# EAGLE design 7segmentDisplay (EAGLE 7.6.0)
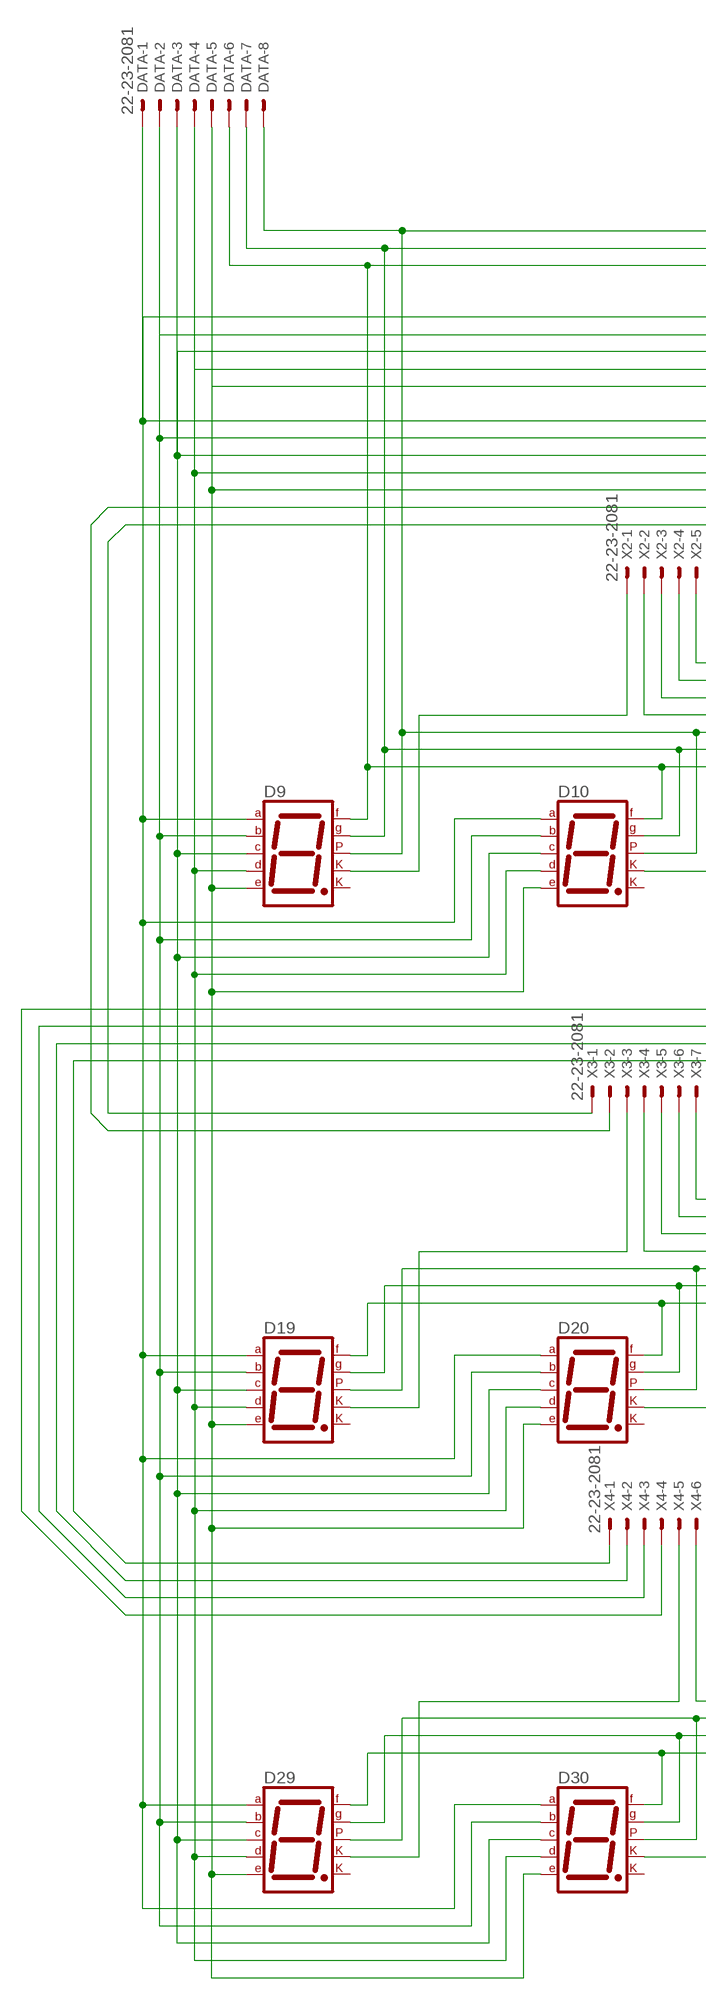
[diagram p0: schematic, sheet 1, part 1 of 2]
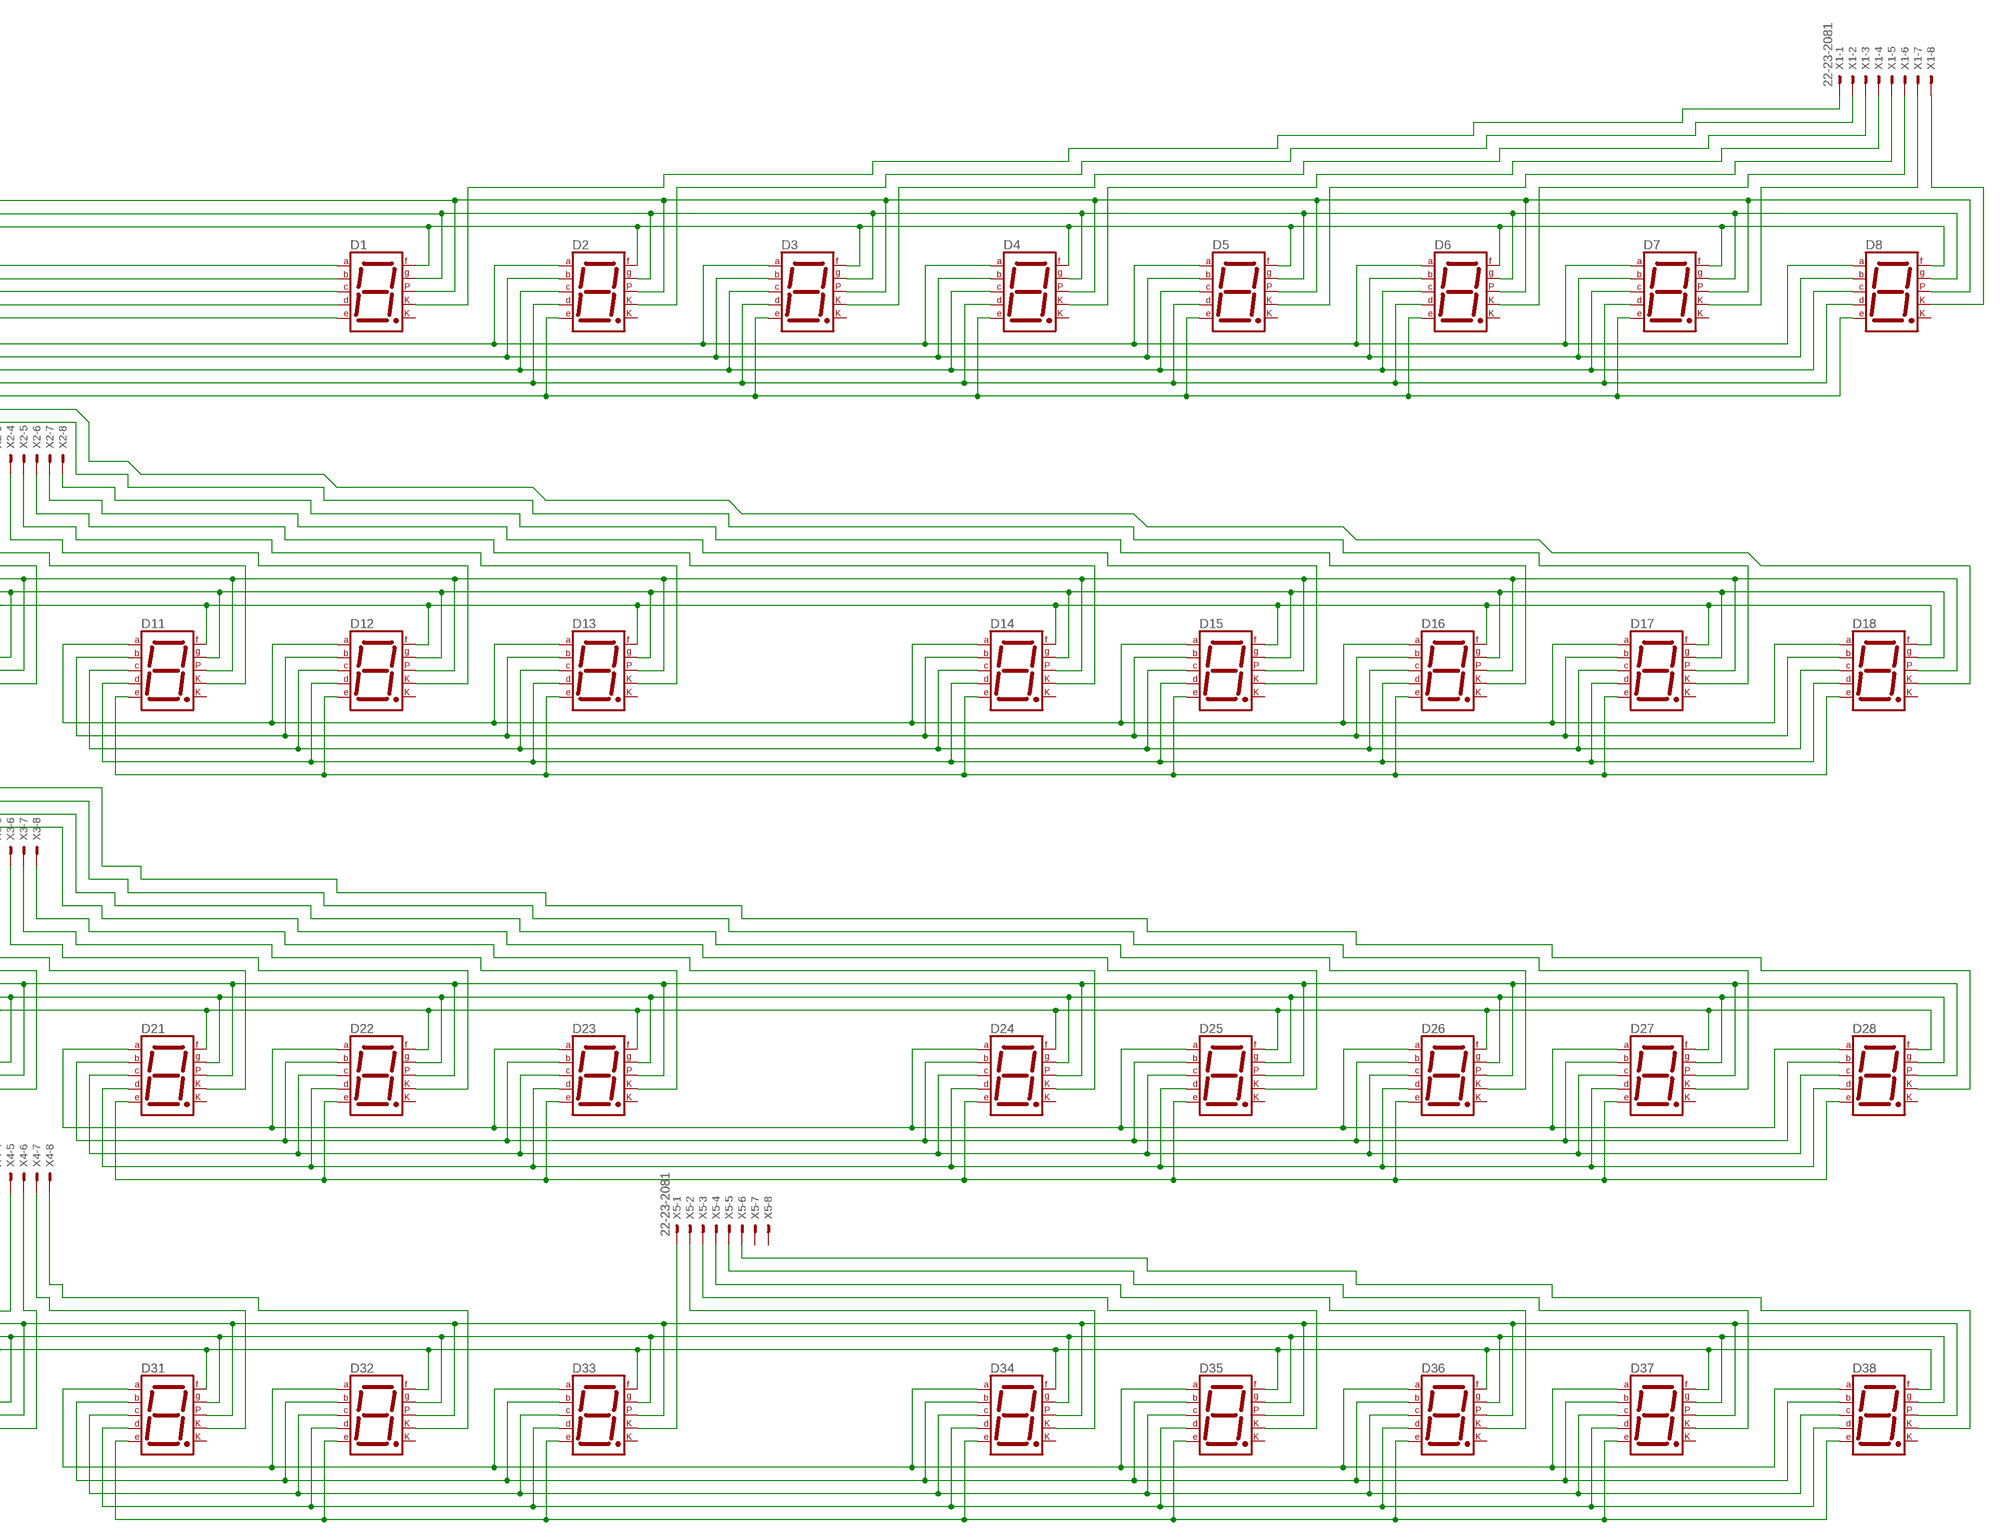
[diagram p1: schematic, sheet 1, part 2 of 2]

## Parts
D1  7SEG-CK  [7SEG-13]
D2  7SEG-CK  [7SEG-13]
D3  7SEG-CK  [7SEG-13]
D4  7SEG-CK  [7SEG-13]
D5  7SEG-CK  [7SEG-13]
D6  7SEG-CK  [7SEG-13]
D7  7SEG-CK  [7SEG-13]
D8  7SEG-CK  [7SEG-13]
D9  7SEG-CK  [7SEG-13]
D10  7SEG-CK  [7SEG-13]
D11  7SEG-CK  [7SEG-13]
D12  7SEG-CK  [7SEG-13]
D13  7SEG-CK  [7SEG-13]
D14  7SEG-CK  [7SEG-13]
D15  7SEG-CK  [7SEG-13]
D16  7SEG-CK  [7SEG-13]
D17  7SEG-CK  [7SEG-13]
D18  7SEG-CK  [7SEG-13]
D19  7SEG-CK  [7SEG-13]
D20  7SEG-CK  [7SEG-13]
D21  7SEG-CK  [7SEG-13]
D22  7SEG-CK  [7SEG-13]
D23  7SEG-CK  [7SEG-13]
D24  7SEG-CK  [7SEG-13]
D25  7SEG-CK  [7SEG-13]
D26  7SEG-CK  [7SEG-13]
D27  7SEG-CK  [7SEG-13]
D28  7SEG-CK  [7SEG-13]
D29  7SEG-CK  [7SEG-13]
D30  7SEG-CK  [7SEG-13]
D31  7SEG-CK  [7SEG-13]
D32  7SEG-CK  [7SEG-13]
D33  7SEG-CK  [7SEG-13]
D34  7SEG-CK  [7SEG-13]
D35  7SEG-CK  [7SEG-13]
D36  7SEG-CK  [7SEG-13]
D37  7SEG-CK  [7SEG-13]
D38  7SEG-CK  [7SEG-13]
DATA  22-23-2081  [22-23-2081]
X1  22-23-2081  [22-23-2081]
X2  22-23-2081  [22-23-2081]
X3  22-23-2081  [22-23-2081]
X4  22-23-2081  [22-23-2081]
X5  22-23-2081  [22-23-2081]

## Nets
N$1: D1.7(A) D2.7(A) D3.7(A) D4.7(A) D5.7(A) D6.7(A) D7.7(A) D8.7(A) D9.7(A) D10.7(A) D19.7(A) D20.7(A) D29.7(A) D30.7(A) DATA.1
N$2: D1.6(B) D2.6(B) D3.6(B) D4.6(B) D5.6(B) D6.6(B) D7.6(B) D8.6(B) D9.6(B) D10.6(B) D19.6(B) D20.6(B) D29.6(B) D30.6(B) DATA.2
N$3: D1.4(C) D2.4(C) D3.4(C) D4.4(C) D5.4(C) D6.4(C) D7.4(C) D8.4(C) D9.4(C) D10.4(C) D19.4(C) D20.4(C) D29.4(C) D30.4(C) DATA.3
N$4: D1.2(D) D2.2(D) D3.2(D) D4.2(D) D5.2(D) D6.2(D) D7.2(D) D8.2(D) D9.2(D) D10.2(D) D19.2(D) D20.2(D) D29.2(D) D30.2(D) DATA.4
N$5: D1.1(E) D2.1(E) D3.1(E) D4.1(E) D5.1(E) D6.1(E) D7.1(E) D8.1(E) D9.1(E) D10.1(E) D19.1(E) D20.1(E) D29.1(E) D30.1(E) DATA.5
N$6: D14.10(G) D15.10(G) D16.10(G) D17.10(G) D18.10(G)
N$7: D5.3(CK1) X1.5
N$8: D2.3(CK1) X1.2
N$9: D3.3(CK1) X1.3
N$10: D4.3(CK1) X1.4
N$11: D9.3(CK1) X2.1
N$12: D6.3(CK1) X1.6
N$13: D7.3(CK1) X1.7
N$14: D21.7(A) D22.7(A) D23.7(A)
N$15: D21.6(B) D22.6(B) D23.6(B)
N$16: D11.7(A) D12.7(A) D13.7(A)
N$17: D11.6(B) D12.6(B) D13.6(B)
N$18: D11.4(C) D12.4(C) D13.4(C)
N$19: D11.2(D) D12.2(D) D13.2(D)
N$20: D11.1(E) D12.1(E) D13.1(E)
N$21: D1.9(F) D2.9(F) D3.9(F) D4.9(F) D5.9(F) D6.9(F) D7.9(F) D8.9(F) D9.9(F) D10.9(F) D11.9(F) D12.9(F) D13.9(F) D14.9(F) D15.9(F) D16.9(F) D17.9(F) D18.9(F) DATA.6
N$22: D1.10(G) D2.10(G) D3.10(G) D4.10(G) D5.10(G) D6.10(G) D7.10(G) D8.10(G) D9.10(G) D10.10(G) D11.10(G) D12.10(G) D13.10(G) DATA.7
N$23: D1.5(DP) D2.5(DP) D3.5(DP) D4.5(DP) D5.5(DP) D6.5(DP) D7.5(DP) D8.5(DP) D9.5(DP) D10.5(DP) D11.5(DP) D12.5(DP) D13.5(DP) D14.5(DP) D15.5(DP) D16.5(DP) D17.5(DP) D18.5(DP) DATA.8
N$24: D8.3(CK1) X1.8
N$25: D11.3(CK1) X2.3
N$26: D14.7(A) D15.7(A) D16.7(A) D17.7(A) D18.7(A)
N$27: D14.6(B) D15.6(B) D16.6(B) D17.6(B) D18.6(B)
N$28: D14.4(C) D15.4(C) D16.4(C) D17.4(C) D18.4(C)
N$29: D14.2(D) D15.2(D) D16.2(D) D17.2(D) D18.2(D)
N$30: D14.1(E) D15.1(E) D16.1(E) D17.1(E) D18.1(E)
N$31: D21.4(C) D22.4(C) D23.4(C)
N$32: D21.2(D) D22.2(D) D23.2(D)
N$33: D21.1(E) D22.1(E) D23.1(E)
N$34: D19.9(F) D20.9(F) D21.9(F) D22.9(F) D23.9(F) D24.9(F) D25.9(F) D26.9(F) D27.9(F) D28.9(F)
N$35: D19.10(G) D20.10(G) D21.10(G) D22.10(G) D23.10(G)
N$36: D19.5(DP) D20.5(DP) D21.5(DP) D22.5(DP) D23.5(DP) D24.5(DP) D25.5(DP) D26.5(DP) D27.5(DP) D28.5(DP)
N$37: D12.3(CK1) X2.4
N$38: D13.3(CK1) X2.5
N$39: D24.7(A) D25.7(A) D26.7(A) D27.7(A) D28.7(A)
N$40: D24.6(B) D25.6(B) D26.6(B) D27.6(B) D28.6(B)
N$41: D24.4(C) D25.4(C) D26.4(C) D27.4(C) D28.4(C)
N$42: D24.2(D) D25.2(D) D26.2(D) D27.2(D) D28.2(D)
N$43: D24.1(E) D25.1(E) D26.1(E) D27.1(E) D28.1(E)
N$44: D24.10(G) D25.10(G) D26.10(G) D27.10(G) D28.10(G)
N$45: D14.3(CK1) X2.6
N$46: D15.3(CK1) X2.7
N$47: D1.3(CK1) X1.1
N$48: D16.3(CK1) X2.8
N$49: D18.3(CK1) X3.2
N$50: D10.3(CK1) X2.2
N$51: D23.3(CK1) X3.7
N$52: D31.7(A) D32.7(A) D33.7(A)
N$53: D31.6(B) D32.6(B) D33.6(B)
N$54: D31.4(C) D32.4(C) D33.4(C)
N$55: D31.2(D) D32.2(D) D33.2(D)
N$56: D31.1(E) D32.1(E) D33.1(E)
N$57: D29.9(F) D30.9(F) D31.9(F) D32.9(F) D33.9(F) D34.9(F) D35.9(F) D36.9(F) D37.9(F) D38.9(F)
N$58: D29.10(G) D30.10(G) D31.10(G) D32.10(G) D33.10(G)
N$59: D29.5(DP) D30.5(DP) D31.5(DP) D32.5(DP) D33.5(DP) D34.5(DP) D35.5(DP) D36.5(DP) D37.5(DP) D38.5(DP)
N$60: D19.3(CK1) X3.3
N$61: D20.3(CK1) X3.4
N$62: D34.7(A) D35.7(A) D36.7(A) D37.7(A) D38.7(A)
N$63: D34.6(B) D35.6(B) D36.6(B) D37.6(B) D38.6(B)
N$64: D34.4(C) D35.4(C) D36.4(C) D37.4(C) D38.4(C)
N$65: D34.2(D) D35.2(D) D36.2(D) D37.2(D) D38.2(D)
N$66: D34.1(E) D35.1(E) D36.1(E) D37.1(E) D38.1(E)
N$67: D34.10(G) D35.10(G) D36.10(G) D37.10(G) D38.10(G)
N$68: D21.3(CK1) X3.5
N$69: D22.3(CK1) X3.6
N$70: D17.3(CK1) X3.1
N$71: D24.3(CK1) X3.8
N$72: D25.3(CK1) X4.1
N$73: D26.3(CK1) X4.2
N$74: D27.3(CK1) X4.3
N$75: D28.3(CK1) X4.4
N$76: D29.3(CK1) X4.5
N$77: D30.3(CK1) X4.6
N$78: D31.3(CK1) X4.7
N$79: D32.3(CK1) X4.8
N$80: D33.3(CK1) X5.1
N$81: D34.3(CK1) X5.2
N$82: D35.3(CK1) X5.3
N$83: D36.3(CK1) X5.4
N$84: D37.3(CK1) X5.5
N$85: D38.3(CK1) X5.6
Unconnected: D1.8(CK2) D2.8(CK2) D3.8(CK2) D4.8(CK2) D5.8(CK2) D6.8(CK2) D7.8(CK2) D8.8(CK2) D9.8(CK2) D10.8(CK2) D11.8(CK2) D12.8(CK2) D13.8(CK2) D14.8(CK2) D15.8(CK2) D16.8(CK2) D17.8(CK2) D18.8(CK2) D19.8(CK2) D20.8(CK2) D21.8(CK2) D22.8(CK2) D23.8(CK2) D24.8(CK2) D25.8(CK2) D26.8(CK2) D27.8(CK2) D28.8(CK2) D29.8(CK2) D30.8(CK2) D31.8(CK2) D32.8(CK2) D33.8(CK2) D34.8(CK2) D35.8(CK2) D36.8(CK2) D37.8(CK2) D38.8(CK2) X5.7 X5.8

## Library data of the parts
D1-D38 = special:7SEG-CK: 7-segment DISPLAY single cathode, 13 mm
DATA X1-X5 = con-molex:22-23-2081: .100" (2.54mm) Center Header - 8 Pin; MF: MOLEX; MPN: 22-23-2081; OC_FARNELL: 1756826; OC_NEWARK: 01C7592

## Net classes
0 default: clearance 0.254 mm

## Board
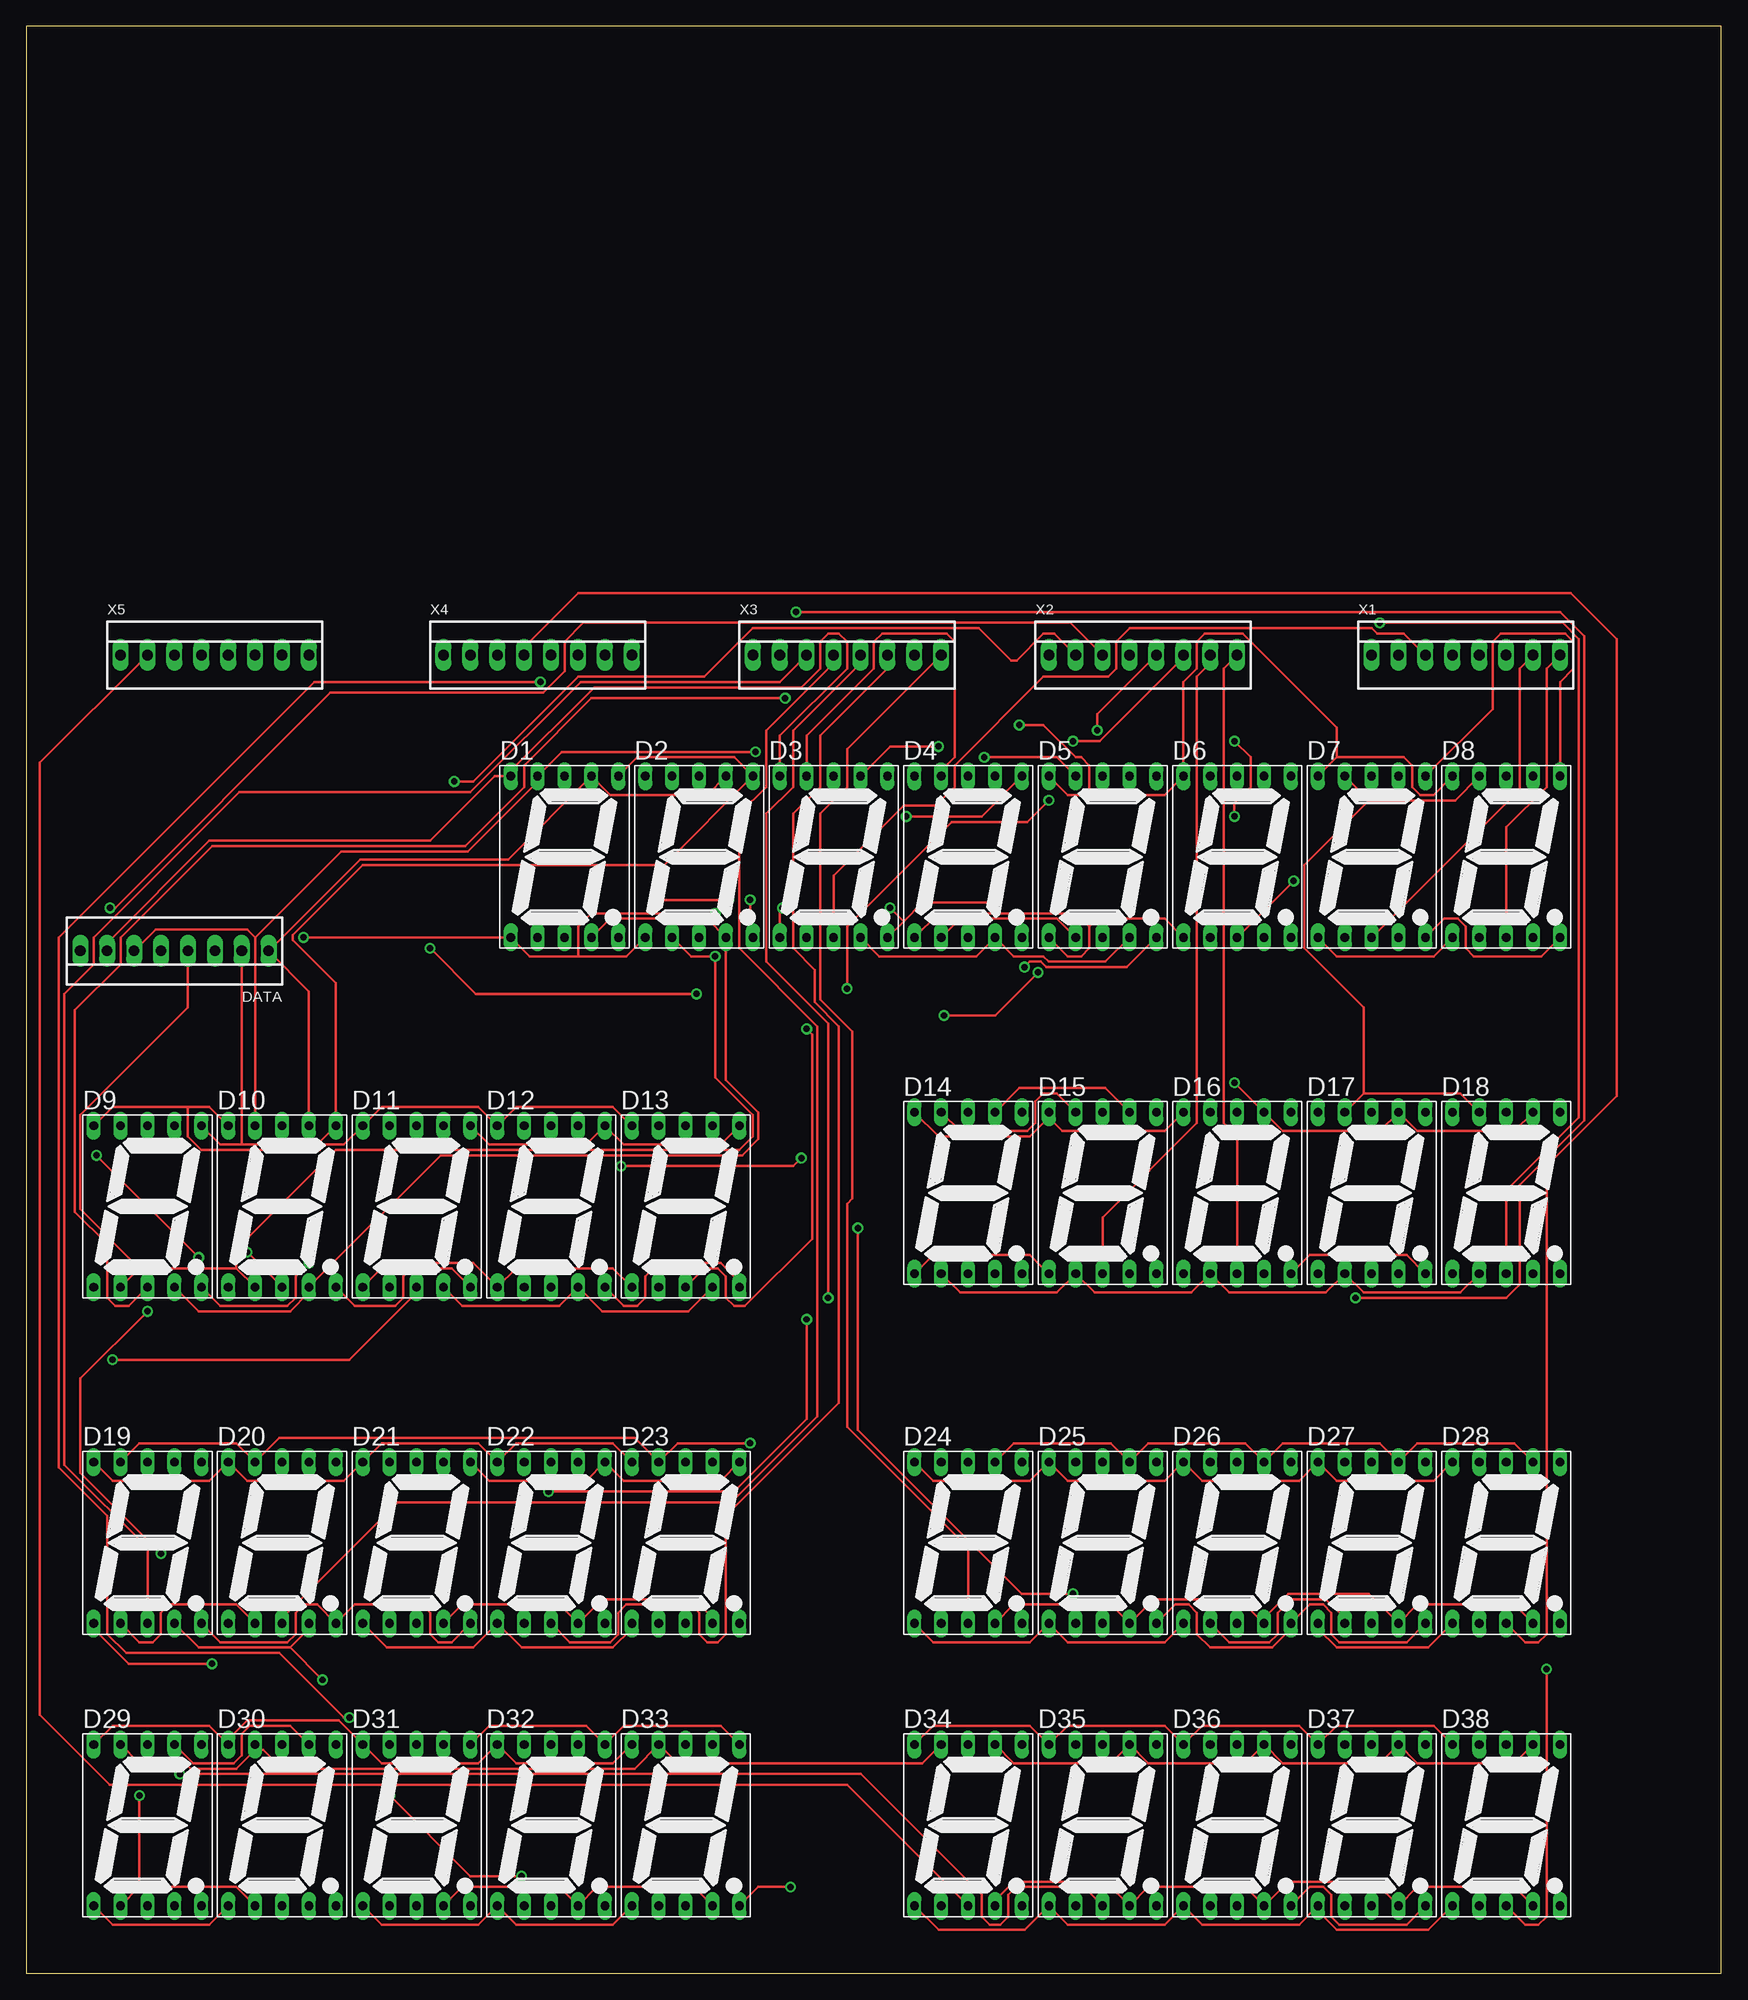
[diagram p2: board, top side]
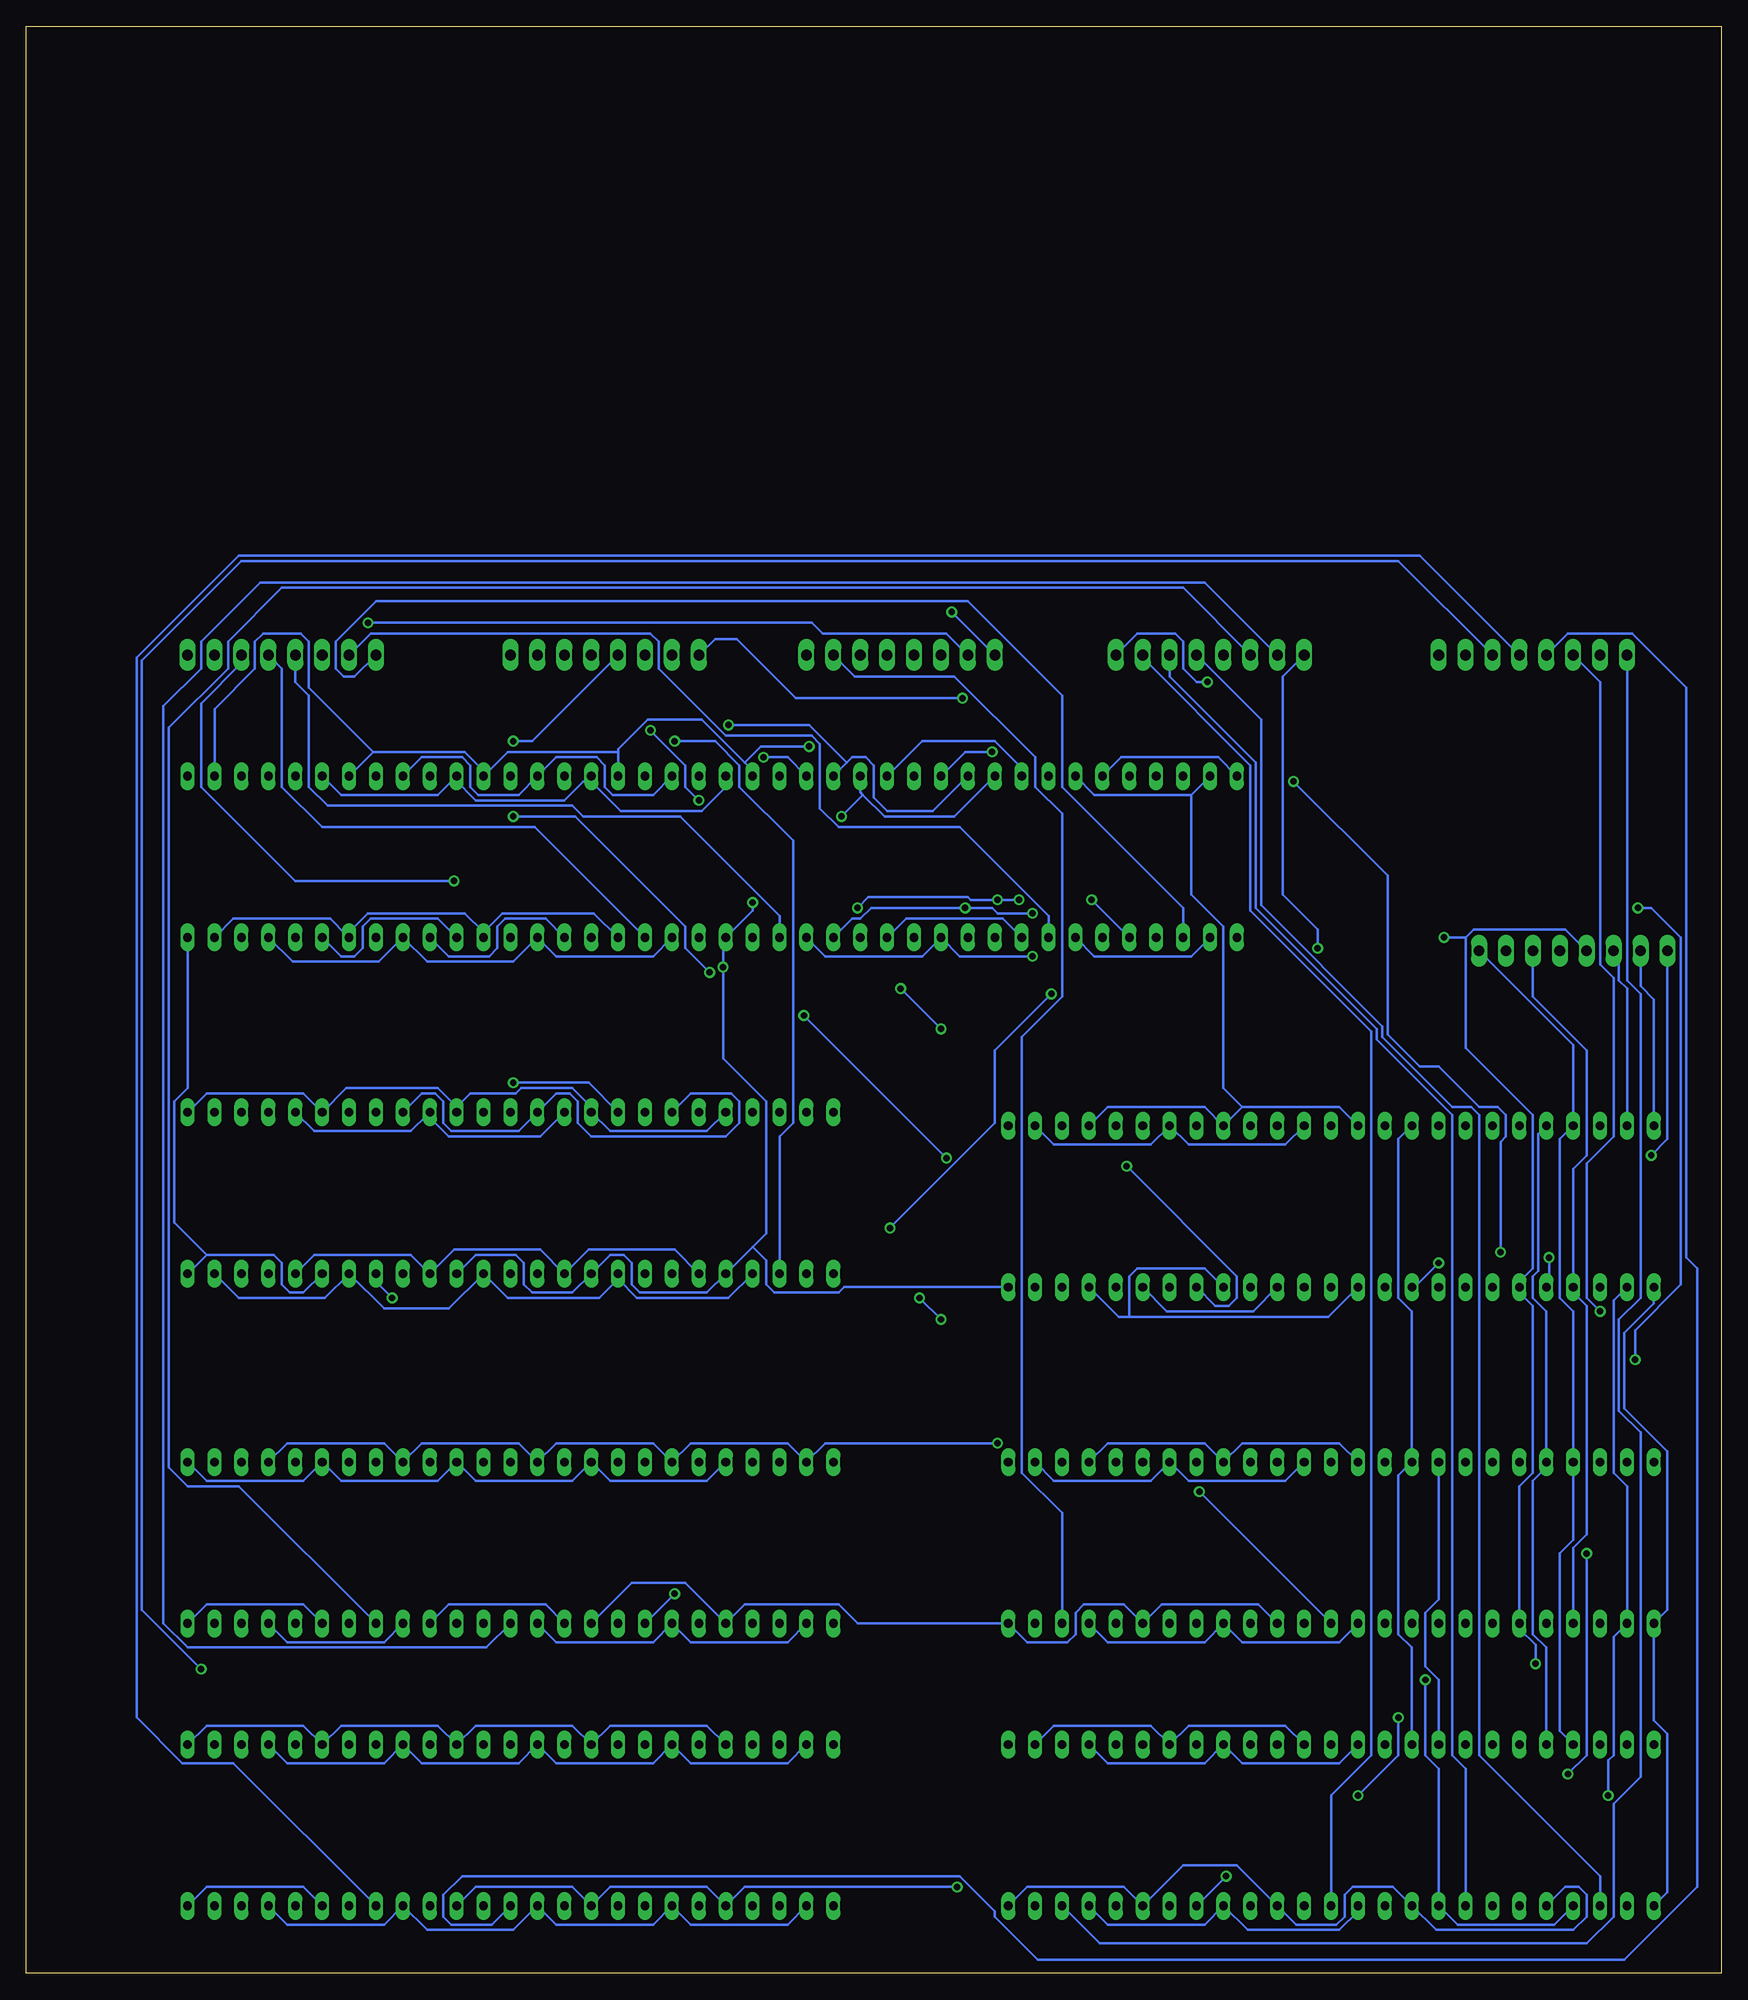
[diagram p3: board, bottom side, seen from below]

Size 160 x 183.82 mm. Coordinates in mm from the lower left corner, seen from the top.
Outline: 0,0 160,0 160,183.82 0,183.82 0,0
Copper layers (1*16): Top 0.035mm / dielectric 1.5mm / Bottom 0.035mm
Design rules "default": minimum track width 10mil, minimum drill 24mil, track to track 8mil, track to pad 8mil, pad to pad 8mil, via to via 8mil, smd to smd 8mil, copper to edge 40mil, drill to drill 8mil, minimum pad ring 10mil, minimum via ring 8mil, stop-mask expansion 4mil, vias tented up to drill 0mil, thermal gap 10mil

### Footprints (pad centres in the part's own frame; a part is rotated, then mirrored left to right if it is on the bottom)
7SEG-13 = drill 0.813 long: 1 -5.08,-7.62; 2 -2.54,-7.62; 3 0,-7.62; 4 2.54,-7.62; 5 5.08,-7.62; 6 5.08,7.62; 7 2.54,7.62; 8 0,7.62; 9 -2.54,7.62; 10 -5.08,7.62
22-23-2081 = drill 1 long: 1 -8.89,0; 2 -6.35,0; 3 -3.81,0; 4 -1.27,0; 5 1.27,0; 6 3.81,0; 7 6.35,0; 8 8.89,0

### Placement (x,y rotation side)
D1  50.8,105.41 0 top
D2  63.5,105.41 0 top
D3  76.2,105.41 0 top
D4  88.9,105.41 0 top
D5  101.6,105.41 0 top
D6  114.3,105.41 0 top
D7  127,105.41 0 top
D8  139.7,105.41 0 top
D9  11.43,72.39 0 top
D10  24.13,72.39 0 top
D11  36.83,72.39 0 top
D12  49.53,72.39 0 top
D13  62.23,72.39 0 top
D14  88.9,73.66 0 top
D15  101.6,73.66 0 top
D16  114.3,73.66 0 top
D17  127,73.66 0 top
D18  139.7,73.66 0 top
D19  11.43,40.64 0 top
D20  24.13,40.64 0 top
D21  36.83,40.64 0 top
D22  49.53,40.64 0 top
D23  62.23,40.64 0 top
D24  88.9,40.64 0 top
D25  101.6,40.64 0 top
D26  114.3,40.64 0 top
D27  127,40.64 0 top
D28  139.7,40.64 0 top
D29  11.43,13.97 0 top
D30  24.13,13.97 0 top
D31  36.83,13.97 0 top
D32  49.53,13.97 0 top
D33  62.23,13.97 0 top
D34  88.9,13.97 0 top
D35  101.6,13.97 0 top
D36  114.3,13.97 0 top
D37  127,13.97 0 top
D38  139.7,13.97 0 top
DATA  13.97,96.52 180 top
X1  135.89,124.46 0 top
X2  105.41,124.46 0 top
X3  77.47,124.46 0 top
X4  48.26,124.46 0 top
X5  17.78,124.46 0 top

### Tracks (layer width: path | path; a pad name or v marks a point on that pad's centre or on a via)
N$1  (via drill 0.61)
  Top 0.254: D29.7 15.75,19.81 19.56,19.81 20.32,20.57 20.32,22.61 21.08,23.37 24.89,23.37 D30.7 | D2.7 64.26,111.25 55.12,111.25 D1.7 45.47,105.16 31.5,105.16 DATA.1 26.67,92.71 D10.7 | v86.11,115.82 81.53,115.82 D3.7
  Bottom 0.254: D4.7 91.44,113.54 92.2,114.3 | 92.2,114.3 96.27,118.36 101.35,118.36 104.14,115.57 104.14,115.32 | D5.7 104.14,115.32 | 116.59,113.28 114.55,115.32 104.14,115.32 | 127.25,115.32 D7.7 | 127.25,115.32 118.62,115.32 116.59,113.28 | 116.59,113.28 D6.7 | D8.7 142.24,119.38 138.43,123.19 138.43,125.73 137.67,126.49 134.11,126.49 133.35,125.73 133.35,121.41 127.25,115.32 | D29.7 15.24,22.86 15.24,39.62 13.97,40.89 D19.7 13.97,62.48 15.24,63.75 15.24,78.74 D9.7 13.97,87.63 DATA.1 | D20.7 26.67,35.31 27.94,34.04 27.94,28.96 26.67,27.69 D30.7 | D3.7 75.44,116.33 68.58,116.33 66.04,113.79 D2.7 | 92.2,114.3 90.68,115.82 v86.11,115.82
N$2  (via drill 0.61)
  Top 0.254: D9.6 18.29,78.23 20.32,78.23 | 20.32,78.23 27.43,78.23 D10.6 29.21,93.47 25.15,97.54 25.15,98.04 31.75,104.65 60.2,104.65 D2.6 66.8,114.81 57.66,114.81 D1.6 | 20.32,78.23 DATA.2 | D8.6 144.78,121.92 146.05,123.19 146.05,125.73 145.29,126.49 139.19,126.49 138.43,125.73 138.43,119.38 D7.6 | v83.06,109.22 90.17,109.22 D4.6
  Bottom 0.254: D30.6 29.21,30.73 30.48,32 30.48,46.99 D20.6 29.21,62.48 30.48,63.75 30.48,78.74 D10.6 | D29.6 16.51,30.73 17.78,32 17.78,46.48 16.51,47.75 D19.6 16.51,62.48 17.78,63.75 17.78,65.79 17.27,66.29 17.27,79.25 D9.6 | D3.6 81.28,111.51 81.03,111.25 | 81.03,111.25 78.99,109.22 72.39,109.22 D2.6 | D4.6 93.98,112.01 96.27,109.73 103.89,109.73 106.68,112.52 | 119.63,112.78 121.16,111.25 130.3,111.25 D7.6 | 106.68,112.52 107.44,112.52 109.22,110.74 117.6,110.74 119.63,112.78 | 106.68,112.52 D5.6 | 119.63,112.78 D6.6 | v83.06,109.22 81.03,111.25
N$3  (via drill 0.61)
  Top 0.254: D1.4 55.12,99.57 64.26,99.57 D2.4 66.04,84.33 69.09,81.28 69.09,78.74 67.56,77.22 39.12,77.22 D10.4 26.67,64.26 24.89,62.48 16.26,62.48 D9.4 | D3.4 80.52,96.01 89.66,96.01 D4.4 93.22,96.01 96.01,96.01 96.52,95.5 101.85,95.5 D5.4 | D19.4 16.26,30.73 24.89,30.73 | 24.89,30.73 26.67,32.51 D20.4 | 24.89,30.73 v27.94,27.69
  Bottom 0.254: 129.79,98.04 131.32,99.57 140.46,99.57 D8.4 | 116.84,98.3 115.06,100.08 106.43,100.08 D5.4 | D2.4 67.82,99.57 76.96,99.57 D3.4 | 129.79,98.04 127.76,100.08 118.62,100.08 116.84,98.3 | 129.79,98.04 D7.4 | 116.84,98.3 D6.4 | D29.4 15.75,4.57 24.89,4.57 D30.4 26.67,19.3 27.94,20.57 v27.94,27.69 | DATA.3 17.78,92.2 12.7,87.12 12.7,77.22 13.97,75.95 D9.4 13.97,64.26 12.7,62.99 12.7,41.4 13.97,40.13 D19.4
N$4  (via drill 0.61)
  Top 0.254: D5.2 97.28,99.57 88.14,99.57 D4.2 | D2.2 62.74,96.01 v65.02,96.01 65.02,84.58 68.58,81.03 68.58,78.99 67.31,77.72 29.21,77.72 19.81,68.33 19.81,66.55 | 10.67,8.13 D29.2 | 10.67,8.13 19.81,8.13 D30.2 | D19.2 10.67,31.24 11.94,31.24 12.7,32 12.7,34.04 13.46,34.8 19.81,34.8 D20.2 | v10.67,16.76 10.67,8.13 | 10.67,66.55 D9.2 | 19.81,66.55 10.67,66.55 | D10.2 19.81,66.55 | DATA.4 15.24,91.19 5.08,81.03 5.08,72.14 10.67,66.55
  Bottom 0.254: D1.2 50.04,96.01 59.18,96.01 D2.2 | D4.2 84.58,96.01 75.44,96.01 D3.2 71.88,96.01 v65.02,96.01 | D5.2 100.84,96.01 109.98,96.01 D6.2 114.05,95.5 122.17,95.5 D7.2 126.75,95.5 134.87,95.5 D8.2 | v10.67,16.76 10.67,20.07 10.16,20.57 10.16,31.75 D19.2 8.89,45.97 10.16,47.24 10.16,63.5 D9.2
N$5  (via drill 0.61)
  Top 0.254: D29.1 8.13,4.57 17.27,4.57 D30.1 | D3.1 71.12,100.33 v71.37,100.58 | D5.1 98.3,96.01 99.57,96.01 100.33,96.77 100.33,98.81 | 100.33,98.81 101.09,99.57 107.44,99.57 D6.1 | D7.1 123.7,96.01 132.84,96.01 D8.1 | D4.1 86.11,100.08 99.06,100.08 100.33,98.81 | 52.07,96.01 56.64,96.01 D2.1 | 52.07,96.01 47.5,96.01 D1.1 v26.16,97.79 | v65.02,100.08 53.34,100.08 52.07,98.81 52.07,96.01 | D19.1 6.35,32.51 9.65,29.21 v17.53,29.21
  Bottom 0.254: D29.1 5.08,7.62 5.08,22.61 6.35,23.88 D19.1 5.08,34.29 5.08,49.28 9.14,53.34 9.14,60.45 6.35,63.25 D9.1 | D4.1 82.04,99.57 81.28,99.57 80.26,100.58 v71.37,100.58 68.83,100.58 68.33,100.08 v65.02,100.08 | D6.1 111,99.57 114.81,99.57 115.57,98.81 115.57,96.77 116.33,96.01 120.14,96.01 D7.1 | DATA.5 14.73,98.55 23.37,98.55 24.13,97.79 | 24.13,97.79 24.13,87.38 17.78,81.03 17.78,66.55 19.05,65.28 D10.1 19.05,64.26 17.78,62.99 17.78,47.24 19.05,45.97 D20.1 19.05,32.51 17.53,30.99 v17.53,29.21 | 24.13,97.79 v26.16,97.79
N$6
  Top 0.254: D14.10 86.11,78.99 94.74,78.99 96.52,80.77 | D16.10 107.44,79.5 97.79,79.5 96.52,80.77 | 96.52,80.77 D15.10
  Bottom 0.254: 122.17,81.03 123.7,79.5 132.84,79.5 D18.10 | 122.17,81.03 120.14,78.99 111.51,78.99 D16.10 | 122.17,81.03 D17.10
N$7
  Bottom 0.254: D5.3 112.01,108.2 132.08,108.2 135.89,112.01 135.89,123.19 X1.5
N$8
  Bottom 0.254: D2.3 63.5,99.82 71.88,108.2 83.31,108.2 85.09,109.98 85.09,116.08 85.85,116.84 93.98,116.84 100.33,123.19 100.33,125.73 101.09,126.49 127.51,126.49 X1.2
N$9
  Top 0.254: D3.3 76.2,103.63 82.8,110.24 85.85,110.24 87.63,112.01 87.63,114.05 96.01,122.43 102.11,122.43 102.87,123.19 102.87,125.73 104.14,127 127,127 127.51,126.49 130.05,126.49 X1.3
N$10
  Bottom 0.254: D4.3 88.9,99.82 98.3,109.22 107.44,109.22 108.46,110.24 131.57,110.24 133.35,112.01 133.35,120.65 134.62,121.92 X1.4
N$11  (via drill 0.61)
  Top 0.254: D9.3 9.65,62.99 8.38,62.99 7.62,63.75 7.62,68.83 4.57,71.88 4.57,90.93 8.89,95.25 8.89,97.79 17.53,106.43 41.4,106.43 46.99,112.01 46.99,114.05 53.34,120.4 v71.63,120.4
  Bottom 0.254: v71.63,120.4 87.38,120.4 92.96,125.98 95,125.98 X2.1
N$12  (via drill 0.61)
  Top 0.254: v119.63,103.12 D6.3
  Bottom 0.254: v119.63,103.12 134.62,103.12 143.51,112.01 143.51,119.89 139.7,123.7 X1.6
N$13
  Top 0.254: D7.3 140.97,111.76 140.97,123.19 X1.7
N$14
  Bottom 0.254: D21.7 41.15,46.48 50.29,46.48 D22.7 53.85,46.48 62.99,46.48 D23.7
N$15
  Top 0.254: D21.6 43.69,46.48 52.83,46.48 D22.6 56.39,46.48 65.53,46.48 D23.6
N$16
  Bottom 0.254: D11.7 41.15,78.23 50.29,78.23 D12.7 53.85,78.23 62.99,78.23 D13.7
N$17
  Top 0.254: D11.6 43.69,78.23 52.83,78.23 D12.6 56.39,78.23 65.53,78.23 D13.6
N$18
  Top 0.254: D11.4 41.15,62.99 50.29,62.99 D12.4 54.36,62.48 62.48,62.48 D13.4
N$19
  Bottom 0.254: D11.2 37.08,61.98 55.88,61.98 | 55.88,61.98 56.9,61.98 D13.2 | D12.2 48.77,66.55 55.12,66.55 55.88,65.79 55.88,61.98
N$20
  Top 0.254: D11.1 34.04,67.06 42.16,67.06 D12.1 46.23,66.55 55.37,66.55 D13.1
N$21  (via drill 0.61)
  Top 0.254: 21.59,97.79 D10.9 | 21.59,97.79 20.83,98.55 12.19,98.55 DATA.6 | 21.59,97.79 29.72,105.92 41.66,105.92 48.26,112.52 D1.9 50.55,115.32 v68.83,115.32 | D14.9 88.14,79.5 94.49,79.5 95.25,80.26 95.25,82.3 96.01,83.06 97.28,83.06 D15.9 | D18.9 135.38,83.06 126.24,83.06 | D17.9 126.24,83.06 | D3.9 73.66,116.84 80.01,123.19 80.01,125.73 80.77,126.49 86.87,126.49 87.63,125.73 87.63,114.81 86.36,113.54 D4.9 | 126.75,110.74 D7.9 | 126.75,110.74 134.87,110.74 D8.9 | v90.42,114.81 97.28,114.81 D5.9 | 126.24,83.06 126.24,91.19 120.65,96.77 120.65,104.65 126.75,110.74
  Bottom 0.254: D9.9 8.89,92.96 9.65,93.73 9.65,96.01 DATA.6 | 50.04,111.25 D1.9 | 50.04,111.25 59.18,111.25 D2.9 | D11.9 36.07,81.79 45.21,81.79 | 45.21,81.79 D12.9 48.77,81.79 57.91,81.79 D13.9 | 50.04,111.25 50.04,101.85 46.99,98.81 46.99,83.57 45.21,81.79 | D17.9 122.68,83.06 121.41,83.06 120.65,82.3 120.65,80.26 119.89,79.5 113.54,79.5 D16.9 109.98,83.06 108.71,83.06 107.95,82.3 107.95,80.26 106.68,78.99 93.98,78.99 92.71,80.26 92.71,82.3 93.47,83.06 97.28,83.06 D15.9 | D5.9 100.84,111.25 104.65,111.25 105.41,112.01 105.41,114.05 106.17,114.81 109.98,114.81 D6.9 113.54,111.25 117.35,111.25 118.11,112.01 118.11,114.05 118.87,114.81 122.68,114.81 D7.9 | D4.9 88.14,114.81 v90.42,114.81 | v68.83,115.32 71.37,115.32 D3.9
N$22  (via drill 0.61)
  Top 0.254: D5.10 98.3,111.25 100.33,111.25 | 100.33,111.25 107.44,111.25 D6.10 109.22,121.92 110.49,123.19 110.49,125.73 111.25,126.49 114.81,126.49 123.7,117.6 123.7,114.81 | 123.7,114.81 D7.10 | 123.7,114.81 130.05,114.81 130.81,114.05 130.81,112.01 131.57,111.25 132.84,111.25 D8.10 | v93.73,117.86 96.01,117.86 99.06,114.81 99.57,114.81 100.33,114.05 100.33,111.25 | D13.10 55.37,81.79 46.23,81.79 D12.10 42.67,81.79 33.53,81.79 D11.10 29.97,78.23 28.19,78.23 27.69,77.72 16.51,77.72 15.24,78.99 15.24,81.79 | D9.10 8.13,81.79 15.24,81.79 | 15.24,81.79 17.27,81.79 D10.10 | 45.21,113.03 44.2,113.03 38.1,106.93 17.27,106.93 7.62,97.28 DATA.7 | D3.10 71.12,116.84 77.47,123.19 77.47,125.73 76.71,126.49 75.69,126.49 74.93,125.73 74.93,123.19 73.15,121.41 53.59,121.41 45.21,113.03 | 45.21,113.03 D1.10
  Bottom 0.254: D3.10 74.42,109.73 78.74,109.73 80.01,111 80.01,114.05 80.77,114.81 82.04,114.81 82.55,114.3 | D4.10 82.55,114.3 | 82.55,114.3 86.11,117.86 v93.73,117.86 | D1.10 47.5,114.81 56.64,114.81 D2.10 | DATA.7 7.62,93.22 6.35,91.95 D9.10
N$23  (via drill 0.61)
  Top 0.254: D13.5 67.31,65.28 65.53,67.06 59.69,67.06 58.42,65.79 58.42,63.75 57.66,62.99 56.39,62.99 D12.5 | D9.5 18.29,62.99 24.64,62.99 25.4,63.75 25.4,65.79 v26.67,67.06 | v16.26,67.56 v6.6,77.22 | D11.5 40.13,66.55 36.32,66.55 35.56,65.79 35.56,63.75 34.8,62.99 30.99,62.99 D10.5 | v66.29,101.35 v59.44,101.35 | v68.33,101.35 68.33,98.04 D2.5 | 82.8,99.31 84.58,101.09 v91.44,101.09 | 82.8,99.31 D3.5 | D5.5 103.89,95 96.27,95 95.76,95.5 94.74,95.5 v94.23,95 | 82.8,99.31 v81.53,100.58 | D8.5 143,96.01 136.65,96.01 135.89,96.77 135.89,98.81 135.13,99.57 133.86,99.57 D7.5 | D16.5 121.16,67.82 130.3,67.82 D17.5
  Bottom 0.254: D11.5 44.2,62.48 52.32,62.48 D12.5 | v26.67,67.06 28.96,64.77 D10.5 | DATA.8 5.08,78.74 v6.6,77.22 | v16.26,67.56 16.26,65.02 D9.5 | v59.44,101.35 D1.5 | v66.29,101.35 v68.33,101.35 70.87,101.35 71.12,101.6 80.52,101.6 v81.53,100.58 | v91.44,101.09 91.44,100.33 D4.5 94.23,97.54 v94.23,95 94.23,86.36 90.17,82.3 90.17,69.85 91.44,68.58 | D6.5 121.16,99.57 127.51,99.57 128.27,98.81 128.27,96.77 129.03,96.01 130.3,96.01 D7.5 | 143,67.82 D18.5 | 143,67.82 136.65,67.82 135.89,67.06 135.89,65.02 135.13,64.26 133.86,64.26 D17.5 | D16.5 117.6,67.82 113.79,67.82 113.03,67.06 113.03,65.02 112.27,64.26 108.46,64.26 D15.5 104.9,67.82 103.63,67.82 102.87,67.06 102.87,65.02 102.11,64.26 95.76,64.26 D14.5 91.44,68.58 | D8.5 144.78,83.57 146.05,82.3 146.05,70.87 143,67.82 | D13.5 82.8,64.77 83.31,64.26 89.41,64.26 90.17,65.02 90.17,67.31 91.44,68.58
N$24
  Top 0.254: D8.3 139.7,108.2 143.51,112.01 143.51,123.19 X1.8
N$25  (via drill 0.61)
  Top 0.254: D11.3 36.83,64.26 30.48,57.91 v8.13,57.91 | v7.87,100.58 8.38,100.58 28.7,120.9 48.77,120.9 50.8,122.94 50.8,125.73 52.58,127.51 98.55,127.51 X2.3
  Bottom 0.254: v8.13,57.91 8.13,60.71 3.81,65.02 3.81,97.79 6.6,100.58 v7.87,100.58
N$26  (via drill 0.61)
  Top 0.254: D14.7 93.73,83.57 101.85,83.57 D15.7 | D18.7 140.46,79.5 131.32,79.5 D17.7 127.76,79.5 118.62,79.5 D16.7 v114.05,84.07
  Bottom 0.254: D15.7 106.93,84.07 v114.05,84.07
N$27
  Bottom 0.254: D14.6 95.76,79.5 104.9,79.5 D15.6 106.68,81.79 108.46,83.57 113.28,83.57 113.79,83.06 118.11,83.06 119.38,81.79 | 119.38,81.79 121.16,83.57 129.79,83.57 D17.6 133.86,83.06 143,83.06 D18.6 | 119.38,81.79 D16.6
N$28
  Bottom 0.254: D18.4 139.95,63.75 131.83,63.75 D17.4 126.24,62.74 120.14,62.74 D16.4 114.55,63.75 105.92,63.75 104.14,65.53 | D14.4 93.73,63.75 102.36,63.75 104.14,65.53 | 104.14,65.53 D15.4
N$29
  Top 0.254: D14.2 88.14,64.26 97.28,64.26 D15.2 100.84,64.26 109.98,64.26 D16.2 113.54,64.26 122.68,64.26 D17.2 126.24,64.26 135.38,64.26 D18.2
N$30
  Top 0.254: D14.1 85.6,67.82 94.74,67.82 D15.1
  Bottom 0.254: D18.1 132.84,67.82 123.7,67.82 D17.1 119.63,68.33 111.51,68.33 D16.1 106.93,68.33 98.81,68.33 D15.1
N$31
  Top 0.254: D21.4 41.15,34.8 50.29,34.8 D22.4 54.36,35.31 62.99,35.31 64.77,33.53 D23.4
N$32
  Bottom 0.254: D21.2 36.07,31.24 45.21,31.24 D22.2 48.77,31.24 57.91,31.24 D23.2
N$33
  Top 0.254: D21.1 34.04,30.73 42.16,30.73 D22.1 46.74,30.73 55.37,30.73 57.15,32.51 D23.1
N$34  (via drill 0.61)
  Top 0.254: D19.9 10.67,50.04 19.81,50.04 D20.9 23.88,50.55 57.4,50.55 D23.9 61.47,50.04 v68.33,50.04
  Bottom 0.254: D28.9 135.38,50.04 126.24,50.04 D27.9 122.68,50.04 113.54,50.04 D26.9 109.98,50.04 100.84,50.04 D25.9 97.28,50.04 88.14,50.04 D24.9 84.58,50.04 v68.33,50.04 | D21.9 36.07,50.04 45.21,50.04 D22.9 48.77,50.04 57.91,50.04 D23.9
N$35
  Top 0.254: D19.10 8.13,46.48 17.27,46.48 D20.10 20.83,46.48 29.97,46.48 D21.10 33.53,50.04 42.67,50.04 D22.10 46.23,50.04 55.37,50.04 D23.10
N$36
  Top 0.254: D19.5 18.29,31.24 24.64,31.24 25.4,32 25.4,34.04 26.16,34.8 27.43,34.8 D20.5 30.99,34.8 37.34,34.8 38.1,34.04 38.1,32 38.86,31.24 40.13,31.24 D21.5 | D27.5 130.3,31.24 123.95,31.24 123.19,32 123.19,34.04 122.43,34.8 121.16,34.8 D26.5 119.38,32.51 117.6,30.73 111.76,30.73 110.49,32 110.49,34.04 109.73,34.8 108.46,34.8 D25.5
  Bottom 0.254: D21.5 43.69,34.8 52.83,34.8 D22.5 56.39,34.8 60.2,34.8 60.96,34.04 60.96,32 61.72,31.24 65.53,31.24 D23.5 81.53,33.02 83.31,34.8 92.2,34.8 D24.5 97.79,36.83 102.87,36.83 D25.5 | D28.5 143,34.8 133.86,34.8 D27.5
N$37  (via drill 0.61)
  Top 0.254: v56.13,76.2 72.39,76.2 v73.15,76.96 | v86.61,90.42 91.44,90.42 v95.5,94.49 | v114.05,109.22 114.05,110.49 115.57,112.01 115.57,114.81 v114.05,116.33
  Bottom 0.254: D12.3 47.75,62.99 46.48,62.99 45.72,63.75 45.72,65.79 v56.13,76.2 | v86.61,90.42 v73.15,76.96 | v95.5,94.49 97.79,96.77 97.79,98.81 108.2,109.22 v114.05,109.22 | v114.05,116.33 112.27,116.33 X2.4
N$38  (via drill 0.61)
  Top 0.254: D13.3 64.01,66.55 65.28,66.55 66.04,65.79 66.04,63.75 66.8,62.99 67.82,62.99 74.17,69.34 74.17,88.65 v73.66,89.15 | v77.47,92.96 77.47,98.81 87.38,108.71 94.49,108.71 v96.52,110.74 | v101.09,117.35 101.09,118.87 X2.5
  Bottom 0.254: v77.47,92.96 v73.66,89.15 | v96.52,110.74 97.79,112.01 97.79,114.05 v101.09,117.35
N$39
  Top 0.254: D24.7 93.22,50.04 102.36,50.04 D25.7 105.92,50.04 115.06,50.04 D26.7 118.62,50.04 127.76,50.04 D27.7 131.32,50.04 140.46,50.04 D28.7
N$40
  Bottom 0.254: D24.6 95.76,46.48 104.9,46.48 D25.6 108.46,46.48 117.6,46.48 D26.6 121.16,46.48 130.3,46.48 D27.6 133.86,46.48 143,46.48 D28.6
N$41
  Top 0.254: D28.4 140.46,34.8 131.32,34.8 D27.4 126.75,35.81 119.13,35.81 116.59,33.27 | D24.4 93.22,34.8 102.36,34.8 D25.4 106.43,35.31 114.55,35.31 116.59,33.27 | 116.59,33.27 D26.4
N$42
  Top 0.254: D27.2 124.46,33.53 122.68,35.31 119.38,35.31 118.11,34.04 118.11,32 117.35,31.24 113.54,31.24 D26.2
  Bottom 0.254: D27.2 126.24,31.24 135.38,31.24 D28.2 | D24.2 88.14,31.24 97.28,31.24 D25.2 100.84,31.24 109.98,31.24 D26.2
N$43
  Top 0.254: D24.1 85.6,31.24 94.74,31.24 D25.1 98.3,31.24 107.44,31.24 D26.1 | D28.1 132.33,30.73 123.7,30.73 121.92,32.51 D27.1
  Bottom 0.254: D27.1 120.14,34.8 111,34.8 D26.1
N$44
  Top 0.254: D24.10 85.6,46.48 94.74,46.48 D25.10 98.3,46.48 107.44,46.48 D26.10 111,46.48 120.14,46.48 D27.10 123.7,46.48 132.84,46.48 D28.10
N$45  (via drill 0.61)
  Top 0.254: v98.81,116.33 101.35,116.33 109.22,124.21 X2.6
  Bottom 0.254: D14.3 88.9,78.99 87.63,80.26 87.63,106.93 92.71,112.01 92.71,114.05 95,116.33 v98.81,116.33
N$46
  Top 0.254: D15.3 101.6,71.37 110.49,80.26 110.49,122.43 111.76,123.7 X2.7
N$47
  Bottom 0.254: D1.3 50.8,100.58 62.23,112.01 62.23,120.65 71.12,129.54 127,129.54 130.81,125.73 130.81,123.19 130.05,122.43 129.03,122.43 X1.1
N$48
  Top 0.254: D16.3 114.3,78.99 113.03,80.26 113.03,123.19 X2.8
N$49  (via drill 0.61)
  Top 0.254: D18.3 139.7,73.91 146.56,80.77 146.56,125.98 145.03,127.51 v127.76,127.51
  Bottom 0.254: v127.76,127.51 85.85,127.51 84.84,126.49 73.15,126.49 X3.2
N$50  (via drill 0.61)
  Top 0.254: v20.83,68.07 D10.3 | v40.39,112.52 42.16,112.52 52.07,122.43 64.01,122.43 68.58,127 89.92,127 92.96,123.95 93.47,123.95 96.01,126.49 97.03,126.49 X2.2
  Bottom 0.254: v20.83,68.07 20.83,78.49 20.32,78.99 20.32,81.03 21.08,81.79 22.86,81.79 26.67,85.6 28.45,85.6 31.5,88.65 31.5,103.63 v40.39,112.52
N$51
  Bottom 0.254: D23.3 62.23,43.43 66.04,47.24 66.04,88.39 62.23,92.2 62.23,109.47 64.77,112.01 64.77,114.81 72.39,122.43 81.79,122.43 X3.7
N$52
  Bottom 0.254: D31.7 41.15,23.37 50.29,23.37 D32.7 53.85,23.37 62.99,23.37 D33.7
N$53
  Top 0.254: D31.6 43.69,23.37 52.83,23.37 D32.6 56.39,23.37 65.53,23.37 D33.6
N$54
  Top 0.254: D31.4 41.15,8.13 50.29,8.13 D32.4 53.85,8.13 62.99,8.13 D33.4
N$55
  Bottom 0.254: D31.2 34.29,5.84 36.07,4.06 44.7,4.06 D32.2 48.77,4.57 57.91,4.57 D33.2
N$56
  Top 0.254: D31.1 33.53,4.57 42.67,4.57 D32.1 46.23,4.57 55.37,4.57 D33.1
N$57
  Top 0.254: D29.9 10.67,19.81 14.99,19.81 15.49,19.3 19.81,19.3 21.59,21.08 | 21.59,21.08 22.35,21.08 24.13,19.3 57.4,19.3 D33.9 61.47,19.81 84.58,19.81 D34.9 | 21.59,21.08 D30.9
  Bottom 0.254: D34.9 88.14,19.81 97.28,19.81 D35.9 100.84,19.81 109.98,19.81 D36.9 113.54,19.81 122.68,19.81 D37.9 126.24,19.81 135.38,19.81 D38.9 | D31.9 36.07,19.81 45.21,19.81 D32.9 48.77,19.81 57.91,19.81 D33.9
N$58
  Top 0.254: D29.10 8.13,23.37 17.27,23.37 18.8,21.84 | D33.10 55.37,19.81 46.23,19.81 D32.10 42.67,19.81 33.53,19.81 D31.10 29.46,23.88 20.83,23.88 18.8,21.84 | 18.8,21.84 D30.10
N$59  (via drill 0.61)
  Top 0.254: D37.5 130.3,4.57 123.95,4.57 123.19,5.33 123.19,7.37 122.43,8.13 121.16,8.13 D36.5 | v72.14,8.13 69.09,8.13 D33.5
  Bottom 0.254: D37.5 133.86,8.13 143,8.13 D38.5 | D36.5 117.6,8.13 108.46,8.13 D35.5 104.9,8.13 95.76,8.13 D34.5 92.2,8.13 v72.14,8.13 | D29.5 14.73,8.13 13.46,8.13 12.7,7.37 12.7,5.33 13.97,4.06 26.92,4.06 D30.5 30.99,8.13 34.8,8.13 35.56,7.37 35.56,5.33 36.32,4.57 40.13,4.57 D31.5 45.72,10.16 50.8,10.16 D32.5 56.39,8.13 65.53,8.13 D33.5
N$60
  Top 0.254: D19.3 11.43,40.13 3.56,48.01 3.56,92.46 6.35,95.25 6.35,97.79 20.07,111.51 41.91,111.51 52.32,121.92 71.12,121.92 X3.3
N$61
  Top 0.254: D20.3 24.13,33.53 35.05,44.45 66.55,44.45 74.68,52.58 74.68,89.41 67.31,96.77 67.31,109.47 69.85,112.01 69.85,117.35 76.2,123.7 X3.4
N$62
  Top 0.254: D34.7 93.22,19.81 102.36,19.81 D35.7 105.92,19.81 115.06,19.81 D36.7 118.62,19.81 127.76,19.81 D37.7 131.32,19.81 140.46,19.81 D38.7
N$63
  Bottom 0.254: D34.6 95.76,23.37 104.9,23.37 D35.6 108.46,23.37 117.6,23.37 D36.6 121.16,23.37 130.3,23.37 D37.6 133.86,23.37 143,23.37 D38.6
N$64
  Top 0.254: D38.4 140.46,8.13 131.32,8.13 D37.4 127.25,8.64 119.13,8.64 D36.4 115.06,8.13 105.92,8.13 D35.4 101.85,8.64 93.22,8.64 91.44,6.86 D34.4
N$65
  Bottom 0.254: D38.2 135.38,4.57 126.24,4.57 D37.2 122.17,4.06 114.05,4.06 D36.2 109.98,4.57 100.84,4.57 D35.2 97.28,4.57 88.14,4.57 D34.2
N$66
  Top 0.254: D34.1 86.11,4.06 94.23,4.06 D35.1 98.3,4.57 107.44,4.57 D36.1 111,4.57 120.14,4.57 121.67,6.1 | D38.1 132.33,4.06 123.7,4.06 121.67,6.1 | 121.67,6.1 D37.1
N$67
  Top 0.254: D34.10 85.6,23.37 94.74,23.37 D35.10 98.3,23.37 107.44,23.37 D36.10 111,23.37 120.14,23.37 D37.10 123.7,23.37 132.84,23.37 D38.10
N$68  (via drill 0.61)
  Top 0.254: v49.28,45.47 66.8,45.47 73.66,52.32 v73.66,61.72 | v75.69,63.75 75.69,89.66 69.85,95.5 69.85,109.47 72.39,112.01 72.39,117.35 78.74,123.7 X3.5
  Bottom 0.254: v49.28,45.47 D21.3 | v75.69,63.75 v73.66,61.72
N$69
  Top 0.254: D22.3 51.31,31.24 55.12,31.24 55.88,32 55.88,34.04 56.64,34.8 62.74,34.8 63.5,34.04 63.5,32 64.26,31.24 65.28,31.24 66.04,32 66.04,43.18 76.71,53.85 76.71,89.41 74.42,91.69 74.42,94.74 72.39,96.77 72.39,109.47 74.93,112.01 74.93,116.84 81.28,123.19 X3.6
N$70  (via drill 0.61)
  Top 0.254: v125.48,63.75 139.7,63.75 140.97,65.02 140.97,74.42 147.07,80.52 147.07,126.24 144.78,128.52 v72.64,128.52
  Bottom 0.254: D17.3 127,65.28 v125.48,63.75 | X3.1 v72.64,128.52
N$71
  Top 0.254: D24.3 88.9,40.13 77.47,51.56 77.47,72.64 77.98,73.15 77.98,88.9 74.93,91.95 74.93,109.47 77.47,112.01 77.47,115.57 X3.8
N$72  (via drill 0.61)
  Top 0.254: v98.81,35.81 93.98,35.81 78.49,51.31 v78.49,70.36 | v63.25,92.46 42.42,92.46 v38.1,96.77
  Bottom 0.254: v98.81,35.81 D25.3 | v78.49,70.36 68.58,80.26 68.58,87.12 v63.25,92.46 | v38.1,96.77 38.1,98.55 41.4,101.85 41.4,122.43 X4.1
N$73
  Bottom 0.254: D26.3 116.59,30.73 144.78,30.73 147.07,33.02 147.07,119.63 143.51,123.19 143.51,125.73 137.92,131.32 48.77,131.32 X4.2
N$74
  Bottom 0.254: D27.3 139.95,45.97 144.78,45.97 146.56,47.75 146.56,117.6 140.97,123.19 140.97,125.73 135.89,130.81 50.8,130.81 X4.3
N$75
  Top 0.254: D28.3 141.48,31.24 142.75,31.24 143.51,32 143.51,76.2 150.11,82.8 150.11,125.98 145.8,130.3 52.07,130.3 46.99,125.22 X4.4
N$76
  Bottom 0.254: D29.3 11.43,9.14 22.86,20.57 22.86,81.03 23.62,81.79 25.4,81.79 32,88.39 32,89.41 43.43,100.84 43.43,118.36 X4.5
N$77
  Bottom 0.254: D30.3 24.13,19.3 25.4,20.57 25.4,81.03 32.51,88.14 32.51,89.15 43.94,100.58 43.94,114.3 52.07,122.43 X4.6
N$78
  Bottom 0.254: D31.3 36.83,16.76 33.02,20.57 33.02,88.9 44.45,100.33 44.45,114.05 54.61,124.21 X4.7
N$79  (via drill 0.61)
  Top 0.254: v46.74,9.14 41.91,9.14 v34.29,16.76 | v30.48,24.13 29.97,24.13 23.88,30.23 9.4,30.23 7.62,32 7.62,43.18 3.05,47.75 3.05,97.79 27.18,121.92 v48.51,121.92
  Bottom 0.254: v46.74,9.14 D32.3 | v34.29,16.76 30.48,20.57 v30.48,24.13 | v48.51,121.92 49.53,121.92 50.8,123.19 50.8,125.73 51.56,126.49 55.12,126.49 X4.8
N$80
  Bottom 0.254: D33.3 58.67,2.79 12.7,2.79 10.16,5.33 10.16,16 7.62,18.54 7.62,51.05 9.65,53.09 9.65,61.72 7.62,63.75 7.62,92.46 8.89,93.73 X5.1
N$81
  Top 0.254: D34.3 77.47,17.78 7.87,17.78 1.27,24.38 1.27,114.3 X5.2
N$82  (via drill 0.61)
  Top 0.254: D35.3 99.82,8.13 93.47,8.13 92.71,7.37 92.71,5.33 91.95,4.57 90.93,4.57 90.17,5.33 90.17,7.37 78.74,18.8 v14.48,18.8 | v12.7,39.62 5.08,47.24 5.08,56.13 v11.43,62.48
  Bottom 0.254: v14.48,18.8 12.7,20.57 v12.7,39.62 | v11.43,62.48 12.7,63.75 12.7,76.45 10.16,78.99 10.16,93.98 11.43,95.25 11.43,121.92 X5.3
N$83
  Bottom 0.254: D36.3 116.08,4.57 119.89,4.57 120.65,5.33 120.65,7.37 118.87,9.14 71.88,9.14 68.58,5.84 68.58,5.33 64.52,1.27 9.14,1.27 2.29,8.13 2.29,66.55 3.3,67.56 3.3,121.41 8.38,126.49 14.48,126.49 X5.4
N$84
  Bottom 0.254: D37.3 140.46,19.81 145.29,19.81 149.61,24.13 149.61,124.21 139.95,133.86 28.45,133.86 X5.5
N$85  (via drill 0.61)
  Top 0.254: D38.3 141.48,4.57 142.75,4.57 143.51,5.33 v143.51,28.7
  Bottom 0.254: v143.51,28.7 149.1,34.29 149.1,123.95 139.7,133.35 30.48,133.35 X5.6